# Altium project Xbee new.PrjPcb
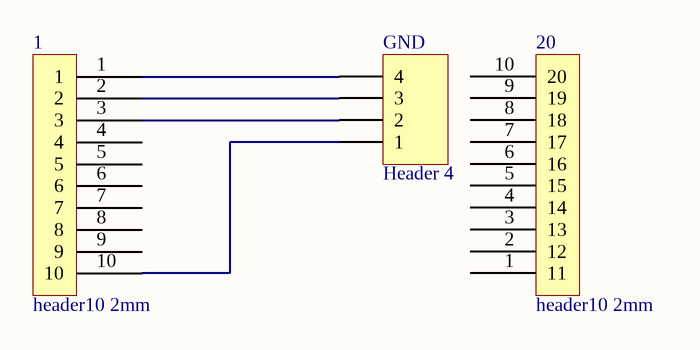
[diagram p0: Sheetchanging.SchDoc]
1 sheet, 3 parts. Net scope: global (net labels, ports and power ports of the same name join across sheets).
Board file: PCB111.PcbDoc

## Sheet Sheetchanging.SchDoc
size A4

### Parts
1  header10 2mm  [header10 2mm big]
20  header10 2mm  [header10 2mm big]
GND  Header 4  [HDR1X4]

### Nets
Net1_1: 1.1 GND.4
Net1_2: 1.2 GND.3
Net1_3: 1.3 GND.2
Net1_10: 1.10 GND.1

Not connected (* = marked no-connect by the designer): 1 4 5 6 7 8 9; 20 1(11) 2(12) 3(13) 4(14) 5(15) 6(16) 7(17) 8(18) 9(19) 10(20)

### Library data of the parts
GND = Header 4: Header, 4-Pin; LatestRevisionDate: 17-Jul-2002; LatestRevisionNote: Re-released for DXP Platform.; Publisher: Altium Limited